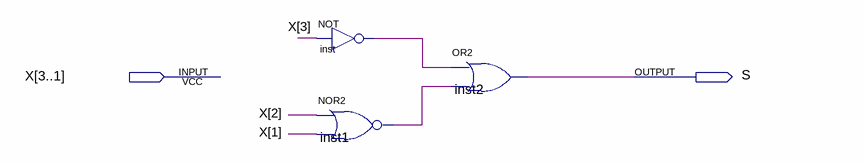
[diagram p0: schematic sheet]
// Quartus schematic inf_eq_9.bdf as structural Verilog: 3 symbols, 2 pins
module inf_eq_9 (
  input  [3:1] X,
  output S
);

  wire inst1_out, inst_out;

  not inst (inst_out, X[3]);
  nor inst1 (inst1_out, X[2], X[1]);
  or inst2 (S, inst_out, inst1_out);
endmodule
